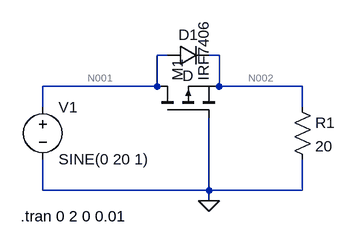
[diagram p0: schematic simu_inv_tension.asc]
simu_inv_tension.asc, the LTspice schematic file:
Version 4
SHEET 1 880 680
WIRE 144 -112 128 -112
WIRE 224 -112 208 -112
WIRE 128 -64 128 -112
WIRE 128 -64 -48 -64
WIRE 224 -64 224 -112
WIRE 352 -64 224 -64
WIRE -48 -32 -48 -64
WIRE 352 -32 352 -64
WIRE -48 96 -48 48
WIRE 208 96 208 -16
WIRE 208 96 -48 96
WIRE 352 96 352 48
WIRE 352 96 208 96
WIRE 208 112 208 96
FLAG 208 112 0
SYMBOL pmos 128 -16 R270
SYMATTR InstName M1
SYMATTR Value IRF7406
SYMBOL voltage -48 -48 R0
WINDOW 123 0 0 Left 0
WINDOW 39 0 0 Left 0
SYMATTR InstName V1
SYMATTR Value SINE(0 20 1)
SYMBOL diode 144 -96 R270
WINDOW 0 32 32 VTop 2
WINDOW 3 0 32 VBottom 2
SYMATTR InstName D1
SYMBOL res 336 -48 R0
SYMATTR InstName R1
SYMATTR Value 20
TEXT -82 136 Left 2 !.tran 0 2 0 0.01

The netlist it stands for:
* simu_inv_tension.asc
M1 N001 0 N002 N002 IRF7406
V1 N001 0 SINE(0 20 1)
D1 N001 N002 D
R1 N002 0 20
.model D D
.lib standard.dio
.model NMOS NMOS
.model PMOS PMOS
.lib standard.mos
.tran 0 2 0 0.01
.backanno
.end

* Results of the author's LTspice run, read from the files saved beside the schematic
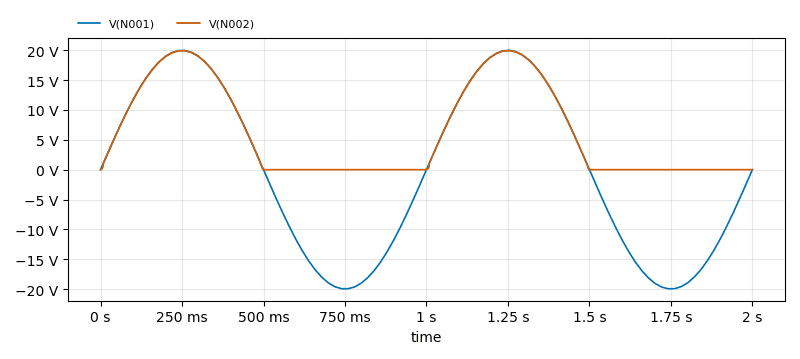
[diagram p1: Transient Analysis of simu_inv_tension.asc, plotted from the saved traces]
* Transient Analysis, 1 run:
*   V(N001): min -19.95 V, max 19.98 V, average -148.3 µV, rms 14.12 V, last 0 V
*   V(N002): min 0 V, max 19.94 V, average 6.336 V, rms 9.971 V, last 0 V